# Altium schematic sheet CAN Communications.SchDoc
size A4; SheetNumber: 2; SheetTotal: 9
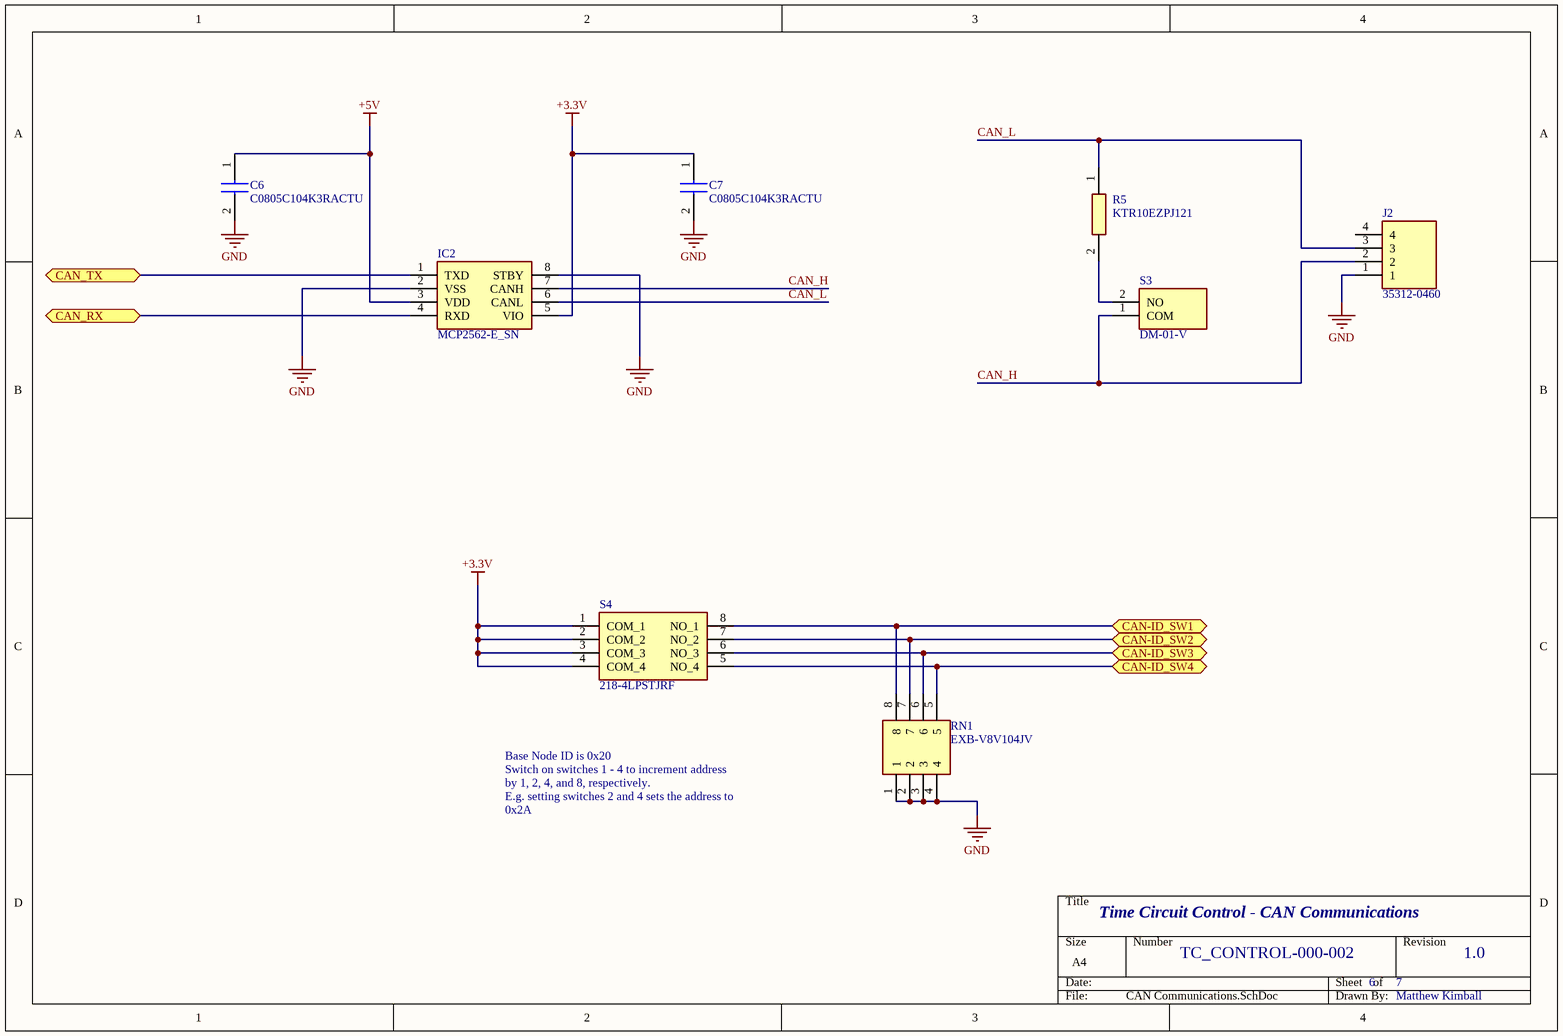
[diagram p0: CAN Communications.SchDoc]

## Parts
C6  C0805C104K3RACTU  [CAPC2012X88N]
C7  C0805C104K3RACTU  [CAPC2012X88N]
IC2  MCP2562-E_SN  [SOIC127P600X175-8N]
J2  35312-0460  [SHDR4W64P0X250_1X4_1246X650X700P]
R5  KTR10EZPJ121  [RESC2012X65N]
RN1  EXB-V8V104JV  [EXBV8V104JV]
S3  DM-01-V  [DM01V]
S4  218-4LPSTJRF  [2184LPSTJRF]

## Ports
CAN-ID_SW1, CAN-ID_SW2, CAN-ID_SW3, CAN-ID_SW4, CAN_RX, CAN_TX

## Nets
+3.3V: C7.1 IC2.5(VIO) S4.1(COM_1) S4.2(COM_2) S4.3(COM_3) S4.4(COM_4)
+5V: C6.1 IC2.3(VDD)
GND: C6.2 C7.2 IC2.2(VSS) IC2.8(STBY) J2.1 RN1.1 RN1.2 RN1.3 RN1.4
CAN-ID_SW1: RN1.8 S4.8(NO_1) ; port CAN-ID_SW1
CAN-ID_SW2: RN1.7 S4.7(NO_2) ; port CAN-ID_SW2
CAN-ID_SW3: RN1.6 S4.6(NO_3) ; port CAN-ID_SW3
CAN-ID_SW4: RN1.5 S4.5(NO_4) ; port CAN-ID_SW4
CAN_H: IC2.7(CANH) J2.2 S3.1(COM)
CAN_L: IC2.6(CANL) J2.3 R5.1
CAN_RX: IC2.4(RXD) ; port CAN_RX
CAN_TX: IC2.1(TXD) ; port CAN_TX
NetR5_2: R5.2 S3.2(NO)

Not connected (* = marked no-connect by the designer): J2 4

## Notes on the sheet
- Base Node ID is 0x20
  Switch on switches 1 - 4 to increment address by 1, 2, 4, and 8, respectively.
  E.g. setting switches 2 and 4 sets the address to 0x2A
- Time Circuit Control - CAN Communications
- TC_CONTROL-000-002
- 6
- 7
- 1.0
- Matthew Kimball

## Library data of the parts
C6 C7 = C0805C104K3RACTU: Capacitor; Manufacturer_Name: Kemet; Datasheet Link: https://componentsearchengine.com/Datasheets/2/C0805C104K3RACTU.pdf; Height: 0.88mm; Manufacturer_Part_Number: C0805C104K3RACTU; Mouser Part Number: 80-C0805C104K3R; Mouser Price/Stock: https://www.mouser.co.uk/ProductDetail/KEMET/C0805C104K3RACTU?qs=zZwvocWqSRjmUvfNxkIN%2Fg%3D%3D; Arrow Part Number: C0805C104K3RACTU; Arrow Price/Stock: https://www.arrow.com/en/products/c0805c104k3ractu/kemet-corporation
IC2 = MCP2562-E_SN: Integrated Circuit; Manufacturer_Name: Microchip; Manufacturer_Part_Number: MCP2562-E/SN; Datasheet Link: http://docs-emea.rs-online.com/webdocs/12a8/0900766b812a88df.pdf; Height: 1.75mm; Mouser Part Number: 579-MCP2562-E/SN; Mouser Price/Stock: https://www.mouser.co.uk/ProductDetail/Microchip-Technology/MCP2562-E-SN?qs=6qKXPk0vzx3LlPUMCCw%252BCg%3D%3D; Arrow Part Number: MCP2562-E/SN; Arrow Price/Stock: https://www.arrow.com/en/products/mcp2562-esn/microchip-technology
J2 = 35312-0460: Connector; Manufacturer_Name: Molex; Datasheet Link: https://www.molex.com/pdm_docs/sd/353120460_sd.pdf; Height: 7mm; Manufacturer_Part_Number: 35312-0460; Mouser Part Number: 538-35312-0460; Mouser Price/Stock: https://www.mouser.co.uk/ProductDetail/Molex/35312-0460?qs=K5bGVUuM57oIWvCwIBpyrQ%3D%3D
R5 = KTR10EZPJ121: Resistor; Manufacturer_Name: ROHM Semiconductor; Datasheet Link: http://rohmfs.rohm.com/en/products/databook/datasheet/passive/resistor/chip_resistor/ktr.pdf; Height: 0.65mm; Manufacturer_Part_Number: KTR10EZPJ121; Mouser Part Number: 755-KTR10EZPJ121; Mouser Price/Stock: https://www.mouser.com/Search/Refine.aspx?Keyword=755-KTR10EZPJ121
RN1 = EXB-V8V104JV: Resistor Network; Manufacturer_Name: Panasonic; Datasheet Link: https://componentsearchengine.com/Datasheets/1/EXB-V8V104JV.pdf; Height: 0.7mm; Manufacturer_Part_Number: EXB-V8V104JV; Mouser Part Number: 667-EXB-V8V104JV; Mouser Price/Stock: https://www.mouser.co.uk/ProductDetail/Panasonic/EXB-V8V104JV?qs=uA7cY%2Fh6FfVDI8hHUId4hQ%3D%3D; Arrow Part Number: EXB-V8V104JV; Arrow Price/Stock: https://www.arrow.com/en/products/exbv8v104jv/panasonic
S3 = DM-01-V: Switch; Manufacturer_Name: Diptronics; Datasheet Link: https://componentsearchengine.com/Datasheets/1/DM-01-V.pdf; Height: 3.91mm; Manufacturer_Part_Number: DM-01-V; Mouser Part Number: 113-DM01V; Mouser Price/Stock: https://www.mouser.co.uk/ProductDetail/Diptronics/DM-01-V?qs=MLItCLRbWswAak4sKQLihA%3D%3D
S4 = 218-4LPSTJRF: Switch; Manufacturer_Name: CTS; Datasheet Link: https://www.ctscorp.com/wp-content/uploads/218.pdf; Height: 2.7mm; Manufacturer_Part_Number: 218-4LPSTJRF; Mouser Part Number: 774-218-4LPSTJRF; Mouser Price/Stock: https://www.mouser.co.uk/ProductDetail/CTS-Electronic-Components/218-4LPSTJRF?qs=6E8igxPflKcofnEJZWfCHQ%3D%3D; Arrow Part Number: 218-4LPSTJRF; Arrow Price/Stock: https://www.arrow.com/en/products/218-4lpstjrf/cts